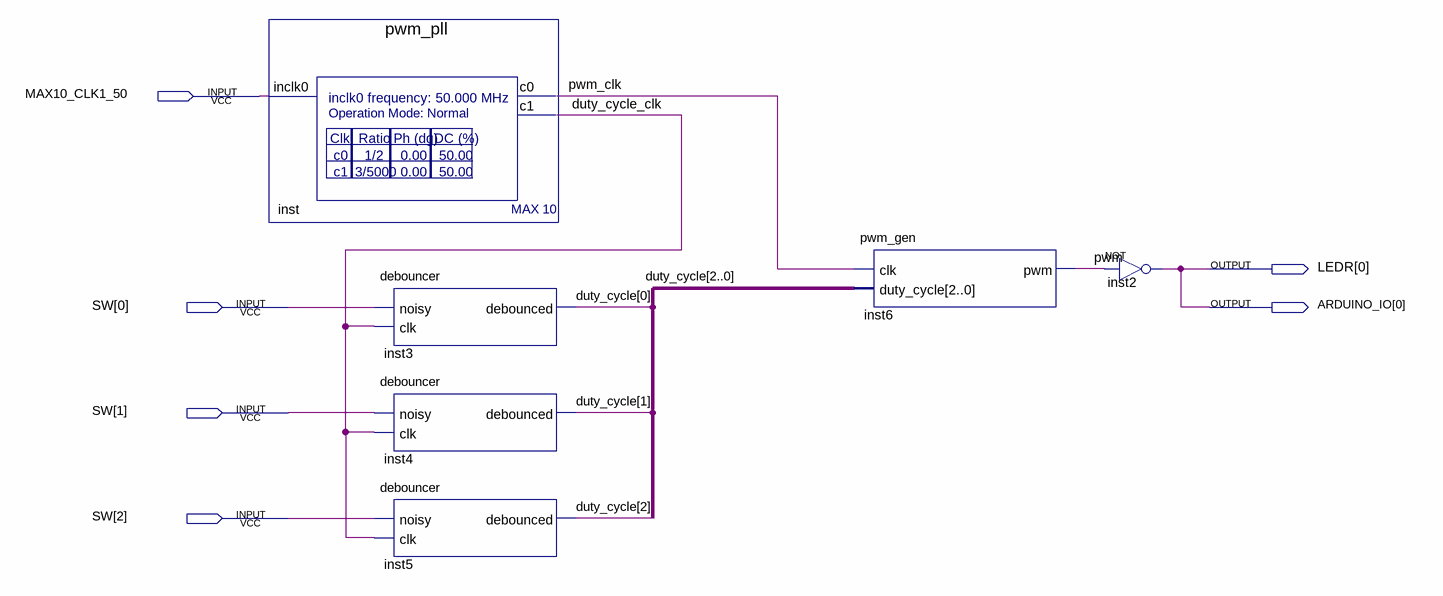
[diagram p0: schematic sheet]
// Quartus schematic pwm_led_top.bdf as structural Verilog: 6 symbols, 6 pins
module pwm_led_top (
  input  MAX10_CLK1_50,
  input  [2:0] SW,
  output [0:0] LEDR,
  output [0:0] ARDUINO_IO
);

  wire duty_cycle_clk, pwm, pwm_clk;
  wire [2:0] duty_cycle;

  pwm_pll inst (.inclk0(MAX10_CLK1_50), .c0(pwm_clk), .c1(duty_cycle_clk));
  debouncer inst3 (.noisy(SW[0]), .clk(duty_cycle_clk), .debounced(duty_cycle[0]));
  debouncer inst4 (.noisy(SW[1]), .clk(duty_cycle_clk), .debounced(duty_cycle[1]));
  debouncer inst5 (.noisy(SW[2]), .clk(duty_cycle_clk), .debounced(duty_cycle[2]));
  pwm_gen inst6 (.clk(pwm_clk), .duty_cycle(duty_cycle), .pwm(pwm));
  not inst2 (ARDUINO_IO[0], pwm);

  assign LEDR[0] = ARDUINO_IO[0];
endmodule
